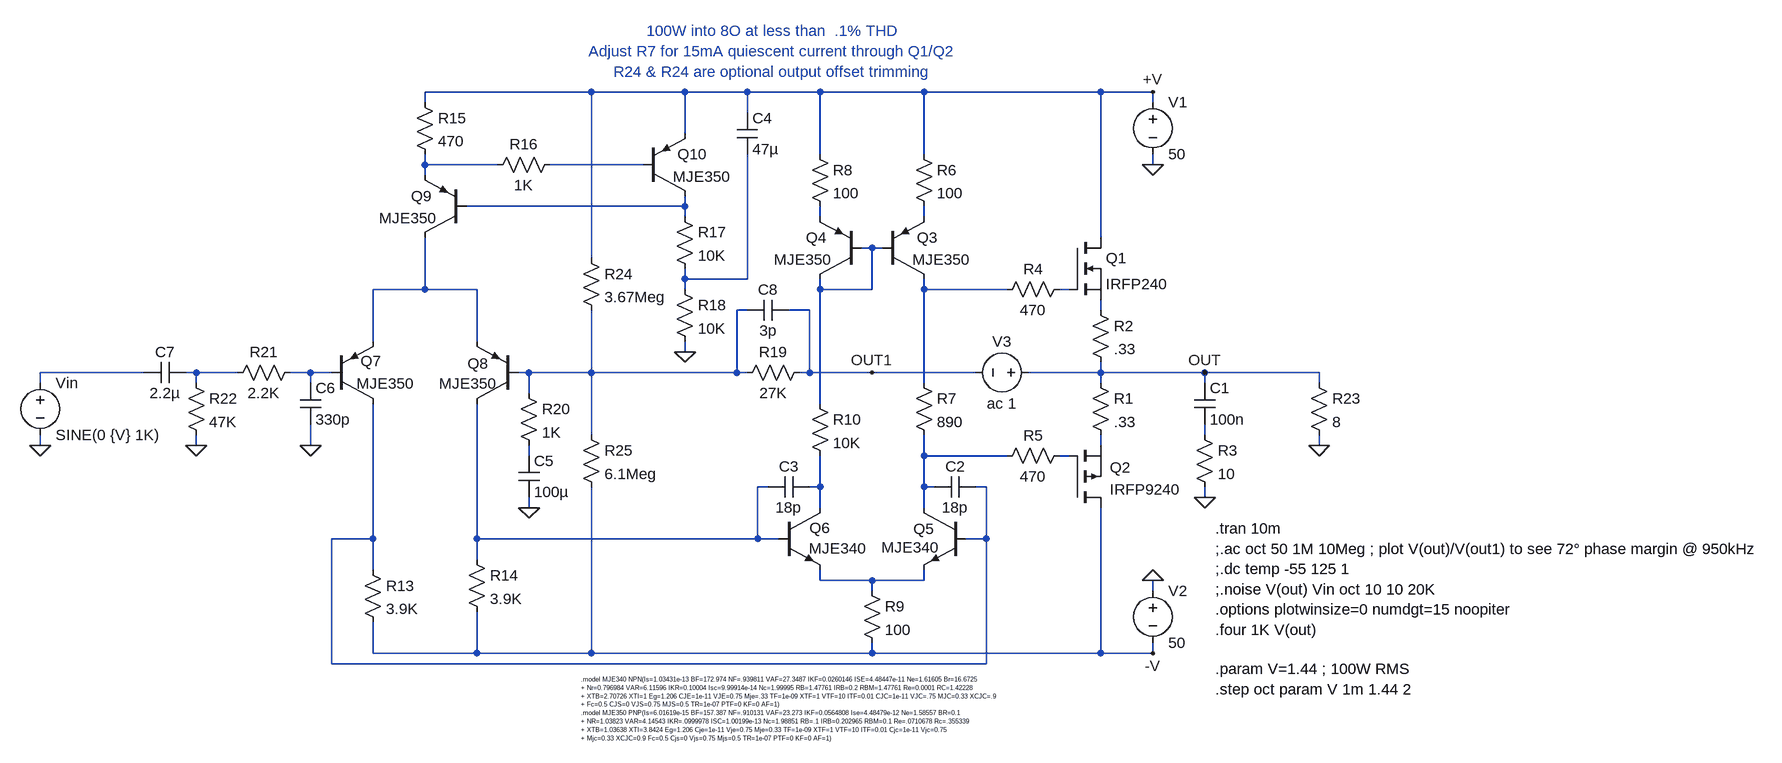
[diagram p0: schematic 100W.asc]
100W.asc, the LTspice schematic file:
Version 4
SHEET 1 2412 1016
WIRE -608 -144 -864 -144
WIRE -464 -144 -608 -144
WIRE -368 -144 -464 -144
WIRE -256 -144 -368 -144
WIRE -96 -144 -256 -144
WIRE 176 -144 -96 -144
WIRE 256 -144 176 -144
WIRE -864 -128 -864 -144
WIRE 256 -128 256 -144
WIRE -368 -112 -368 -144
WIRE -464 -80 -464 -144
WIRE -256 -48 -256 -144
WIRE -96 -48 -96 -144
WIRE -864 -32 -864 -48
WIRE -752 -32 -864 -32
WIRE -528 -32 -672 -32
WIRE 256 -32 256 -48
WIRE -864 -16 -864 -32
WIRE -464 32 -464 16
WIRE -464 32 -800 32
WIRE -464 48 -464 32
WIRE -256 48 -256 32
WIRE -96 48 -96 32
WIRE 176 80 176 -144
WIRE -176 96 -192 96
WIRE -160 96 -176 96
WIRE -608 112 -608 -144
WIRE -464 144 -464 128
WIRE -368 144 -368 -48
WIRE -368 144 -464 144
WIRE -864 160 -864 80
WIRE -864 160 -944 160
WIRE -784 160 -864 160
WIRE -464 160 -464 144
WIRE -256 160 -256 144
WIRE -176 160 -176 96
WIRE -176 160 -256 160
WIRE -96 160 -96 144
WIRE 32 160 -96 160
WIRE 128 160 112 160
WIRE -368 192 -384 192
WIRE -272 192 -304 192
WIRE 176 192 176 176
WIRE -944 240 -944 160
WIRE -784 240 -784 160
WIRE -464 256 -464 240
WIRE -1296 288 -1456 288
WIRE -1216 288 -1232 288
WIRE -1152 288 -1216 288
WIRE -1040 288 -1072 288
WIRE -1008 288 -1040 288
WIRE -704 288 -720 288
WIRE -608 288 -608 192
WIRE -608 288 -704 288
WIRE -384 288 -384 192
WIRE -384 288 -608 288
WIRE -368 288 -384 288
WIRE -272 288 -272 192
WIRE -272 288 -288 288
WIRE -176 288 -272 288
WIRE -16 288 -176 288
WIRE 176 288 176 272
WIRE 176 288 64 288
WIRE 336 288 176 288
WIRE 512 288 336 288
WIRE -1456 304 -1456 288
WIRE -1216 304 -1216 288
WIRE -1040 304 -1040 288
WIRE -96 304 -96 160
WIRE 176 304 176 288
WIRE 336 304 336 288
WIRE 512 304 512 288
WIRE -704 320 -704 288
WIRE -256 336 -256 160
WIRE -608 384 -608 288
WIRE 336 384 336 368
WIRE -1456 400 -1456 384
WIRE -1216 400 -1216 384
WIRE -1040 400 -1040 368
WIRE 176 400 176 384
WIRE 512 400 512 384
WIRE -704 416 -704 400
WIRE -96 416 -96 384
WIRE 32 416 -96 416
WIRE 128 416 112 416
WIRE -336 464 -352 464
WIRE -256 464 -256 416
WIRE -256 464 -272 464
WIRE -96 464 -96 416
WIRE -80 464 -96 464
WIRE 0 464 -16 464
WIRE 336 480 336 464
WIRE -704 496 -704 480
WIRE -256 496 -256 464
WIRE -96 496 -96 464
WIRE -944 544 -944 336
WIRE -944 544 -1008 544
WIRE -784 544 -784 336
WIRE -352 544 -352 464
WIRE -352 544 -784 544
WIRE -320 544 -352 544
WIRE 0 544 0 464
WIRE 0 544 -32 544
WIRE -784 576 -784 544
WIRE -944 592 -944 544
WIRE -256 608 -256 592
WIRE -176 608 -256 608
WIRE -96 608 -96 592
WIRE -96 608 -176 608
WIRE -176 624 -176 608
WIRE 256 624 256 608
WIRE -944 720 -944 672
WIRE -784 720 -784 656
WIRE -784 720 -944 720
WIRE -608 720 -608 464
WIRE -608 720 -784 720
WIRE -176 720 -176 704
WIRE -176 720 -608 720
WIRE 176 720 176 496
WIRE 176 720 -176 720
WIRE 256 720 256 704
WIRE 256 720 176 720
WIRE -1008 736 -1008 544
WIRE 0 736 0 544
WIRE 0 736 -1008 736
FLAG 336 480 0
FLAG 256 -32 0
FLAG 256 608 0
FLAG -464 256 0
FLAG -704 496 0
FLAG -1040 400 0
FLAG -1216 400 0
FLAG -1456 400 0
FLAG 336 288 OUT
FLAG 512 400 0
FLAG 256 -144 +V
FLAG 256 720 -V
FLAG -176 288 OUT1
SYMBOL nmos 128 80 R0
SYMATTR InstName Q1
SYMATTR Value IRFP240
SYMBOL pmos 128 496 M180
WINDOW 0 62 62 Left 2
WINDOW 3 62 28 Left 2
SYMATTR InstName Q2
SYMATTR Value IRFP9240
SYMBOL res 160 288 R0
SYMATTR InstName R1
SYMATTR Value .33
SYMBOL res 160 176 R0
SYMATTR InstName R2
SYMATTR Value .33
SYMBOL cap 320 304 R0
SYMATTR InstName C1
SYMATTR Value 100n
SYMBOL res 320 368 R0
SYMATTR InstName R3
SYMATTR Value 10
SYMBOL res 128 144 R90
WINDOW 0 0 56 VBottom 2
WINDOW 3 32 56 VTop 2
SYMATTR InstName R4
SYMATTR Value 470
SYMBOL res 128 400 R90
WINDOW 0 0 56 VBottom 2
WINDOW 3 32 56 VTop 2
SYMATTR InstName R5
SYMATTR Value 470
SYMBOL voltage 256 -144 R0
SYMATTR InstName V1
SYMATTR Value 50
SYMBOL voltage 256 608 R0
SYMATTR InstName V2
SYMATTR Value 50
SYMBOL pnp -160 144 M180
WINDOW 0 53 64 Left 2
WINDOW 3 46 30 Left 2
SYMATTR InstName Q3
SYMATTR Value MJE350
SYMBOL pnp -192 144 R180
WINDOW 0 53 64 Left 2
WINDOW 3 46 30 Left 2
SYMATTR InstName Q4
SYMATTR Value MJE350
SYMBOL res -112 -64 R0
SYMATTR InstName R6
SYMATTR Value 100
SYMBOL res -112 288 R0
SYMATTR InstName R7
SYMATTR Value 890
SYMBOL npn -32 496 M0
WINDOW 0 48 33 Left 2
WINDOW 3 41 61 Left 2
SYMATTR InstName Q5
SYMATTR Value MJE340
SYMBOL res -272 -64 R0
SYMATTR InstName R8
SYMATTR Value 100
SYMBOL res -192 608 R0
SYMATTR InstName R9
SYMATTR Value 100
SYMBOL npn -320 496 R0
WINDOW 0 48 31 Left 2
WINDOW 3 47 63 Left 2
SYMATTR InstName Q6
SYMATTR Value MJE340
SYMBOL cap -16 448 R90
WINDOW 0 0 32 VBottom 2
WINDOW 3 32 32 VTop 2
SYMATTR InstName C2
SYMATTR Value 18p
SYMBOL cap -272 448 R90
WINDOW 0 0 32 VBottom 2
WINDOW 3 32 32 VTop 2
SYMATTR InstName C3
SYMATTR Value 18p
SYMBOL res -272 320 R0
SYMATTR InstName R10
SYMATTR Value 10K
SYMBOL pnp -1008 336 M180
WINDOW 0 45 66 Left 2
WINDOW 3 39 31 Left 2
SYMATTR InstName Q7
SYMATTR Value MJE350
SYMBOL pnp -720 336 R180
WINDOW 0 46 62 Left 2
WINDOW 3 34 31 Left 2
SYMATTR InstName Q8
SYMATTR Value MJE350
SYMBOL res -960 576 R0
SYMATTR InstName R13
SYMATTR Value 3.9K
SYMBOL res -800 560 R0
SYMATTR InstName R14
SYMATTR Value 3.9K
SYMBOL pnp -800 80 R180
WINDOW 0 53 64 Left 2
WINDOW 3 46 30 Left 2
SYMATTR InstName Q9
SYMATTR Value MJE350
SYMBOL res -880 -144 R0
SYMATTR InstName R15
SYMATTR Value 470
SYMBOL res -656 -48 R90
WINDOW 0 0 56 VBottom 2
WINDOW 3 32 56 VTop 2
SYMATTR InstName R16
SYMATTR Value 1K
SYMBOL pnp -528 16 M180
WINDOW 0 53 64 Left 2
WINDOW 3 46 30 Left 2
SYMATTR InstName Q10
SYMATTR Value MJE350
SYMBOL res -480 32 R0
SYMATTR InstName R17
SYMATTR Value 10K
SYMBOL res -480 144 R0
SYMATTR InstName R18
SYMATTR Value 10K
SYMBOL cap -384 -112 R0
SYMATTR InstName C4
SYMATTR Value 47µ
SYMBOL res -272 272 R90
WINDOW 0 0 56 VBottom 2
WINDOW 3 32 56 VTop 2
SYMATTR InstName R19
SYMATTR Value 27K
SYMBOL res -720 304 R0
SYMATTR InstName R20
SYMATTR Value 1K
SYMBOL cap -720 416 R0
SYMATTR InstName C5
SYMATTR Value 100µ
SYMBOL cap -1056 304 R0
SYMATTR InstName C6
SYMATTR Value 330p
SYMBOL res -1056 272 R90
WINDOW 0 0 56 VBottom 2
WINDOW 3 32 56 VTop 2
SYMATTR InstName R21
SYMATTR Value 2.2K
SYMBOL res -1232 288 R0
SYMATTR InstName R22
SYMATTR Value 47K
SYMBOL cap -1232 272 R90
WINDOW 0 0 32 VBottom 2
WINDOW 3 32 32 VTop 2
SYMATTR InstName C7
SYMATTR Value 2.2µ
SYMBOL voltage -1456 288 R0
WINDOW 123 24 122 Left 2
WINDOW 39 0 0 Left 0
SYMATTR InstName Vin
SYMATTR Value SINE(0 {V} 1K)
SYMBOL res 496 288 R0
SYMATTR InstName R23
SYMATTR Value 8
SYMBOL res -624 96 R0
SYMATTR InstName R24
SYMATTR Value 3.67Meg
SYMBOL res -624 368 R0
SYMATTR InstName R25
SYMATTR Value 6.1Meg
SYMBOL voltage 80 288 R90
WINDOW 0 -32 56 VBottom 2
WINDOW 3 32 56 VTop 2
SYMATTR InstName V3
SYMATTR Value ac 1
SYMBOL cap -304 176 R90
WINDOW 0 0 32 VBottom 2
WINDOW 3 32 32 VTop 2
SYMATTR InstName C8
SYMATTR Value 3p
TEXT 352 528 Left 2 !.tran 10m\n;.ac oct 50 1M 10Meg ; plot V(out)/V(out1) to see 72° phase margin @ 950kHz\n;.dc temp -55 125 1\n;.noise V(out) Vin oct 10 10 20K\n.options plotwinsize=0 numdgt=15 noopiter\n.four 1K V(out)
TEXT -624 760 Left 0 !.model MJE340 NPN(Is=1.03431e-13 BF=172.974 NF=.939811 VAF=27.3487 IKF=0.0260146 ISE=4.48447e-11 Ne=1.61605 Br=16.6725\n+ Nr=0.796984 VAR=6.11596 IKR=0.10004 Isc=9.99914e-14 Nc=1.99995 RB=1.47761 IRB=0.2 RBM=1.47761 Re=0.0001 RC=1.42228\n+ XTB=2.70726 XTI=1 Eg=1.206 CJE=1e-11 VJE=0.75 Mje=.33 TF=1e-09 XTF=1 VTF=10 ITF=0.01 CJC=1e-11 VJC=.75 MJC=0.33 XCJC=.9\n+ Fc=0.5 CJS=0 VJS=0.75 MJS=0.5 TR=1e-07 PTF=0 KF=0 AF=1)\n.model MJE350 PNP(Is=6.01619e-15 BF=157.387 NF=.910131 VAF=23.273 IKF=0.0564808 Ise=4.48479e-12 Ne=1.58557 BR=0.1\n+ NR=1.03823 VAR=4.14543 IKR=.0999978 ISC=1.00199e-13 Nc=1.98851 RB=.1 IRB=0.202965 RBM=0.1 Re=.0710678 Rc=.355339\n+ XTB=1.03638 XTI=3.8424 Eg=1.206 Cje=1e-11 Vje=0.75 Mje=0.33 TF=1e-09 XTF=1 VTF=10 ITF=0.01 Cjc=1e-11 Vjc=0.75\n+ Mjc=0.33 XCJC=0.9 Fc=0.5 Cjs=0 Vjs=0.75 Mjs=0.5 TR=1e-07 PTF=0 KF=0 AF=1)
TEXT 352 744 Left 2 !.param V=1.44 ; 100W RMS\n.step oct param V 1m 1.44 2
TEXT -328 -160 Bottom 2 ;100W into 8O at less than  .1% THD\nAdjust R7 for 15mA quiescent current through Q1/Q2\nR24 & R24 are optional output offset trimming

The netlist it stands for:
* 100W.asc
M§Q1 +V N010 N012 N012 IRFP240
M§Q2 -V N020 N017 N017 IRFP9240
R1 OUT N017 .33
R2 N012 OUT .33
C1 OUT N016 100n
R3 N016 0 10
R4 N010 N009 470
R5 N020 N019 470
V1 +V 0 50
V2 0 -V 50
Q3 N009 N006 N005 0 MJE350
Q4 N006 N006 N004 0 MJE350
R6 +V N005 100
R7 N009 N019 890
Q5 N019 N023 N024 0 MJE340
R8 +V N004 100
R9 N024 -V 100
Q6 N022 N021 N024 0 MJE340
C2 N023 N019 18p
C3 N022 N021 18p
R10 N006 N022 10K
Q7 N023 N015 N008 0 MJE350
Q8 N021 N011 N008 0 MJE350
R13 N023 -V 3.9K
R14 N021 -V 3.9K
Q9 N008 N003 N001 0 MJE350
R15 +V N001 470
R16 N002 N001 1K
Q10 N003 N002 +V 0 MJE350
R17 N003 N007 10K
R18 N007 0 10K
C4 +V N007 47µ
R19 OUT1 N011 27K
R20 N011 N018 1K
C5 N018 0 100µ
C6 N015 0 330p
R21 N015 N014 2.2K
R22 N014 0 47K
C7 N014 N013 2.2µ
Vin N013 0 SINE(0 {V} 1K)
R23 OUT 0 8
R24 +V N011 3.67Meg
R25 N011 -V 6.1Meg
V3 OUT OUT1 ac 1
C8 OUT1 N011 3p
.model NPN NPN
.model PNP PNP
.lib standard.bjt
.model NMOS NMOS
.model PMOS PMOS
.lib standard.mos
.tran 10m
;.ac oct 50 1M 10Meg ; plot V(out)/V(out1) to see 72° phase margin @ 950kHz
;.dc temp -55 125 1
;.noise V(out) Vin oct 10 10 20K
.options plotwinsize=0 numdgt=15 noopiter
.four 1K V(out)
.model MJE340 NPN(Is=1.03431e-13 BF=172.974 NF=.939811 VAF=27.3487 IKF=0.0260146 ISE=4.48447e-11 Ne=1.61605 Br=16.6725
+ Nr=0.796984 VAR=6.11596 IKR=0.10004 Isc=9.99914e-14 Nc=1.99995 RB=1.47761 IRB=0.2 RBM=1.47761 Re=0.0001 RC=1.42228
+ XTB=2.70726 XTI=1 Eg=1.206 CJE=1e-11 VJE=0.75 Mje=.33 TF=1e-09 XTF=1 VTF=10 ITF=0.01 CJC=1e-11 VJC=.75 MJC=0.33 XCJC=.9
+ Fc=0.5 CJS=0 VJS=0.75 MJS=0.5 TR=1e-07 PTF=0 KF=0 AF=1)
.model MJE350 PNP(Is=6.01619e-15 BF=157.387 NF=.910131 VAF=23.273 IKF=0.0564808 Ise=4.48479e-12 Ne=1.58557 BR=0.1
+ NR=1.03823 VAR=4.14543 IKR=.0999978 ISC=1.00199e-13 Nc=1.98851 RB=.1 IRB=0.202965 RBM=0.1 Re=.0710678 Rc=.355339
+ XTB=1.03638 XTI=3.8424 Eg=1.206 Cje=1e-11 Vje=0.75 Mje=0.33 TF=1e-09 XTF=1 VTF=10 ITF=0.01 Cjc=1e-11 Vjc=0.75
+ Mjc=0.33 XCJC=0.9 Fc=0.5 Cjs=0 Vjs=0.75 Mjs=0.5 TR=1e-07 PTF=0 KF=0 AF=1)
.param V=1.44 ; 100W RMS
.step oct param V 1m 1.44 2
* 100W into 8O at less than  .1% THD
* Adjust R7 for 15mA quiescent current through Q1/Q2
* R24 & R24 are optional output offset trimming
.backanno
.end